# EasyEDA schematic easyeda_schematic.json
TITLE: Line Following Car diagram; REV: 1.0; Date: 2026-01-27; Sheet: 1/1; Drawn By: kylelopin; Company: UW Platteville
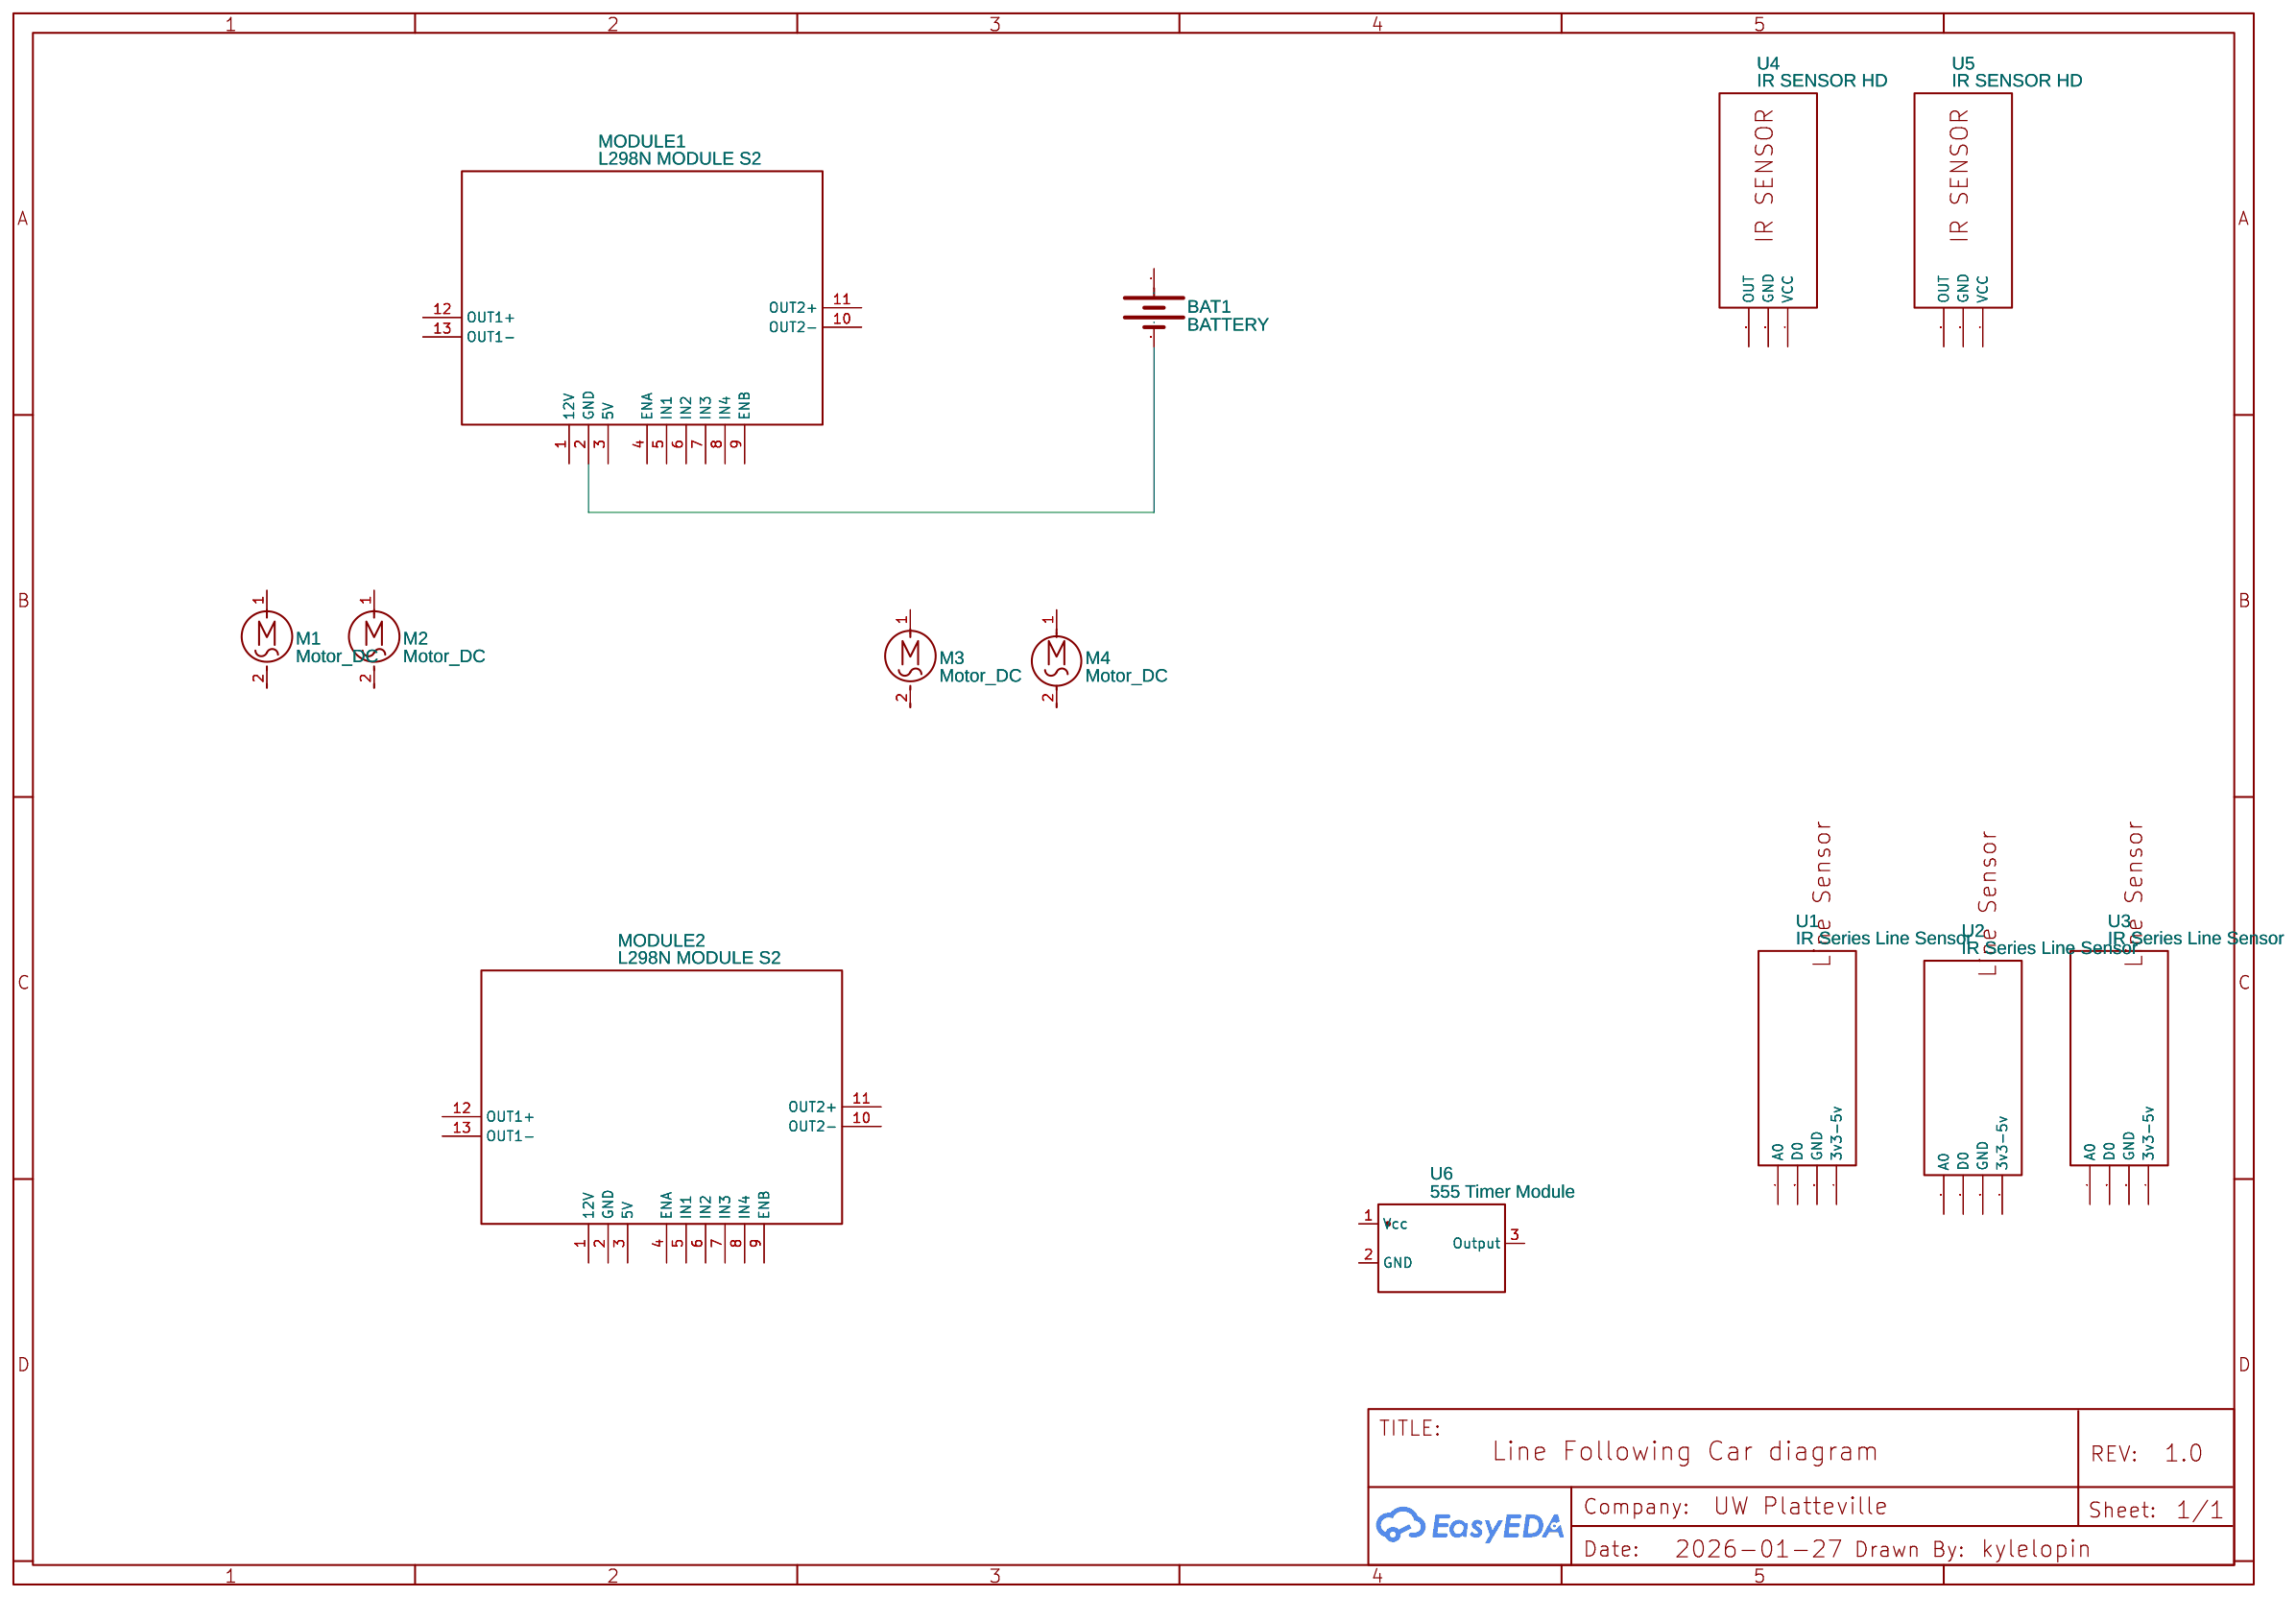
[diagram p0: schematic sheet]

## Parts
BAT1  BATTERY  [BATTCON_20MM]
M1  Motor_DC
M2  Motor_DC
M3  Motor_DC
M4  Motor_DC
MODULE1  L298N MODULE S2  [L298N DUAL H-BRIDGE MOTOR DRIVER MODULE]
MODULE2  L298N MODULE S2  [L298N DUAL H-BRIDGE MOTOR DRIVER MODULE]
U1  IR Series Line Sensor  [MH-SENSOR-SERIES-LINE-SENSOR]
U2  IR Series Line Sensor  [MH-SENSOR-SERIES-LINE-SENSOR]
U3  IR Series Line Sensor  [MH-SENSOR-SERIES-LINE-SENSOR]
U4  IR SENSOR HD  [MH-SENSOR-SERIES-LINE-SENSOR]
U5  IR SENSOR HD  [MH-SENSOR-SERIES-LINE-SENSOR]
U6  555 Timer Module

## Library data of the parts
BAT1 = BATTERY: Contributor: SparkFun
M1-M4 = Motor_AC: Contributor: KiCAD; license: https://www.gnu.org/licenses/lgpl-2.1.html
MODULE1 MODULE2 = L298N MODULE S2: Contributor: kylelopin
U1-U3 = MH-Sensor-Series Line Sensor: Contributor: Mahedi Hassan
U4 U5 = MH-Sensor-Series Line Sensor: Contributor: pcbhd
U6 = 555 Timer Module: Contributor: kylelopin

## Nets
Net-(BAT1-2): BAT1.2(-) MODULE1.2(GND)

Not connected (* = marked no-connect by the designer): BAT1 1(+); M1 1 2; M2 1 2; M3 1 2; M4 1 2; MODULE1 1(12V) 3(5V) 4(ENA) 5(IN1) 6(IN2) 7(IN3) 8(IN4) 9(ENB) 10(OUT2-) 11(OUT2+) 12(OUT1+) 13(OUT1-); MODULE2 1(12V) 2(GND) 3(5V) 4(ENA) 5(IN1) 6(IN2) 7(IN3) 8(IN4) 9(ENB) 10(OUT2-) 11(OUT2+) 12(OUT1+) 13(OUT1-); U1 1(A0) 2(D0) 3(GND) 4(3v3-5v); U2 1(A0) 2(D0) 3(GND) 4(3v3-5v); U3 1(A0) 2(D0) 3(GND) 4(3v3-5v); U4 2(OUT) 3(GND) 4(VCC); U5 2(OUT) 3(GND) 4(VCC); U6 1(Vcc) 2(GND) 3(Output)
